# EAGLE design rcio_v1 (EAGLE 9.6.2)
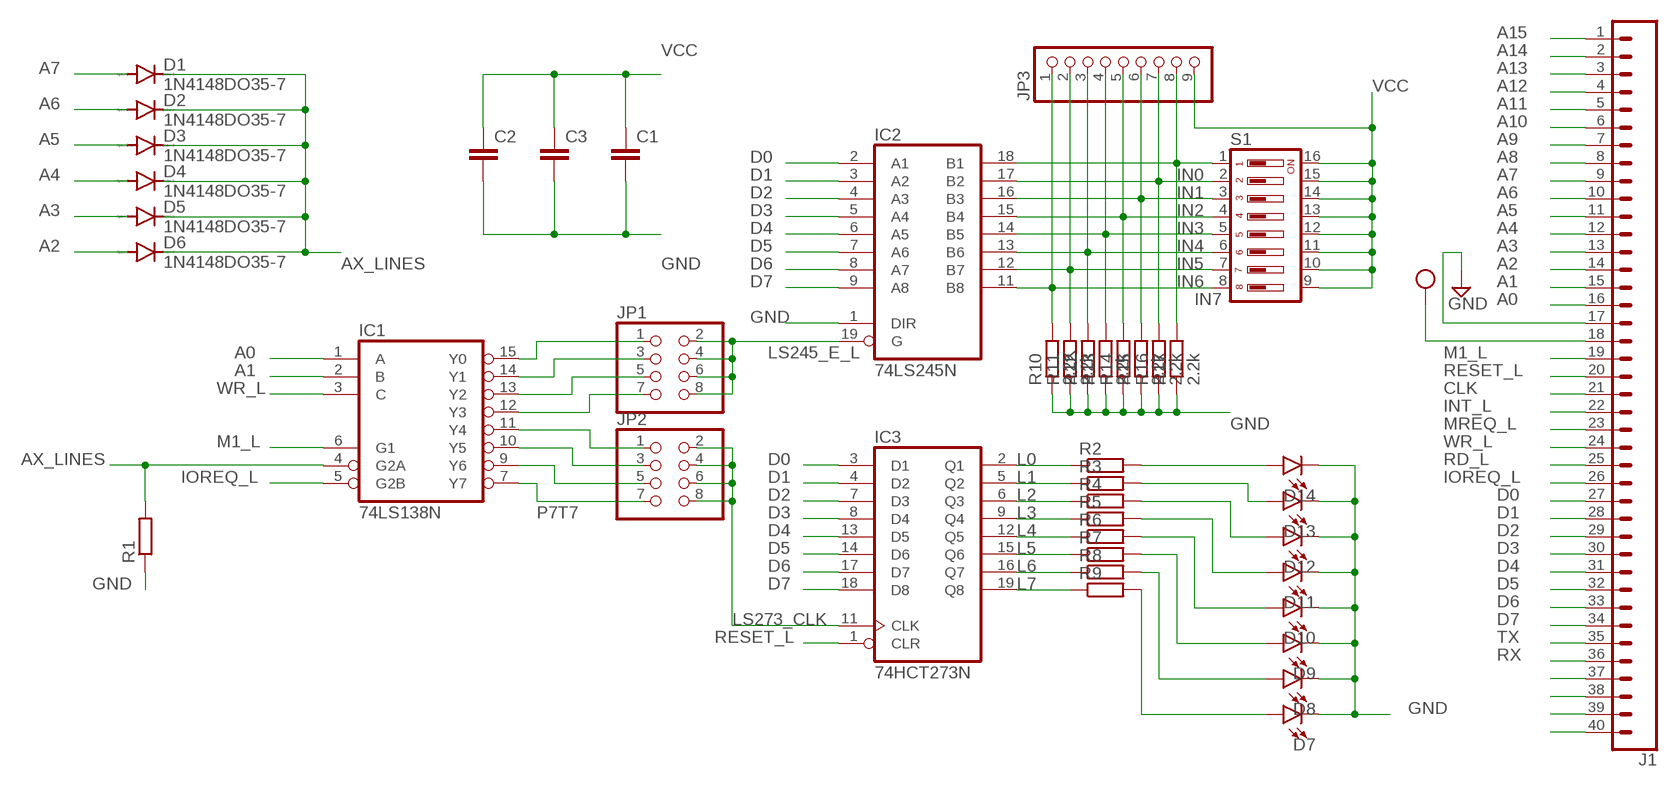
[diagram p0: schematic, sheet 1]

## Parts
C1  C-EU050-025X075  [C050-025X075]
C2  C-EU050-025X075  [C050-025X075]
C3  C-EU050-025X075  [C050-025X075]
D1  1N4148DO35-7  [DO35-7]
D2  1N4148DO35-7  [DO35-7]
D3  1N4148DO35-7  [DO35-7]
D4  1N4148DO35-7  [DO35-7]
D5  1N4148DO35-7  [DO35-7]
D6  1N4148DO35-7  [DO35-7]
D7  LED3MM  [LED_3MM]
D8  LED3MM  [LED_3MM]
D9  LED3MM  [LED_3MM]
D10  LED3MM  [LED_3MM]
D11  LED3MM  [LED_3MM]
D12  LED3MM  [LED_3MM]
D13  LED3MM  [LED_3MM]
D14  LED3MM  [LED_3MM]
IC1  74LS138N  [DIL16]
IC2  74LS245N  [DIL20]
IC3  74HCT273N  [DIL20]
J1  CONN_40OFFSET  [1X40_OFFSET]
JP1  PINHD-2X4  [2X04]
JP2  PINHD-2X4  [2X04]
JP3  PINHD-1X9  [1X09]
R1  R-EU_0204/7  [0204/7]
R2  R-EU_0204/7  [0204/7]
R3  R-EU_0204/7  [0204/7]
R4  R-EU_0204/7  [0204/7]
R5  R-EU_0204/7  [0204/7]
R6  R-EU_0204/7  [0204/7]
R7  R-EU_0204/7  [0204/7]
R8  R-EU_0204/7  [0204/7]
R9  R-EU_0204/7  [0204/7]
R10  2.2K  R-EU_0204/7  [0204/7]
R11  2.2k  R-EU_0204/7  [0204/7]
R12  R-EU_0204/7  [0204/7]
R13  2.2k  R-EU_0204/7  [0204/7]
R14  R-EU_0204/7  [0204/7]
R15  2.2k  R-EU_0204/7  [0204/7]
R16  2.2k  R-EU_0204/7  [0204/7]
R17  2.2k  R-EU_0204/7  [0204/7]
S1  DP08  [DP-08]

## Nets
A0: IC1.1(A) J1.16
A1: IC1.2(B) J1.15
A2: D6.A J1.14
A3: D5.A J1.13
A4: D4.A J1.12
A5: D3.A J1.11
A6: D2.A J1.10
A7: D1.A J1.9
A8: J1.8
A9: J1.7
A10: J1.6
A11: J1.5
A12: J1.4
A13: J1.3
A14: J1.2
A15: J1.1
AX_LINES: D1.C D2.C D3.C D4.C D5.C D6.C IC1.4(G2A) R1.2
CLK: J1.21
D0: IC2.2(A1) IC3.3(D1) J1.27
D1: IC2.3(A2) IC3.4(D2) J1.28
D2: IC2.4(A3) IC3.7(D3) J1.29
D3: IC2.5(A4) IC3.8(D4) J1.30
D4: IC2.6(A5) IC3.13(D5) J1.31
D5: IC2.7(A6) IC3.14(D6) J1.32
D6: IC2.8(A7) IC3.17(D7) J1.33
D7: IC2.9(A8) IC3.18(D8) J1.34
GND: C1.2 C2.2 C3.2 D7.K(C) D8.K(C) D9.K(C) D10.K(C) D11.K(C) D12.K(C) D13.K(C) D14.K(C) IC2.1(DIR) J1.17 R1.1 R10.1 R11.1 R12.1 R13.1 R14.1 R15.1 R16.1 R17.1
IN0: IC2.18(B1) JP3.8 R17.2 S1.1
IN1: IC2.17(B2) JP3.7 R16.2 S1.2
IN2: IC2.16(B3) JP3.6 R15.2 S1.3
IN3: IC2.15(B4) JP3.5 R14.2 S1.4
IN4: IC2.14(B5) JP3.4 R13.2 S1.5
IN5: IC2.13(B6) JP3.3 R12.2 S1.6
IN6: IC2.12(B7) JP3.2 R11.2 S1.7
IN7: IC2.11(B8) JP3.1 R10.2 S1.8
INT_L: J1.22
IOREQ_L: IC1.5(G2B) J1.26
L0: IC3.2(Q1) R2.1
L1: IC3.5(Q2) R3.1
L2: IC3.6(Q3) R4.1
L3: IC3.9(Q4) R5.1
L4: IC3.12(Q5) R6.1
L5: IC3.15(Q6) R7.1
L6: IC3.16(Q7) R8.1
L7: IC3.19(Q8) R9.1
LED7: D7.A R9.2
LS245_E_L: IC2.19(G) JP1.2 JP1.4 JP1.6 JP1.8
LS273_CLK: IC3.11(CLK) JP2.2 JP2.4 JP2.6 JP2.8
M1_L: IC1.6(G1) J1.19
MREQ_L: J1.23
N$1: J1.37
N$2: J1.38
N$3: J1.39
N$4: IC1.15(Y0) JP1.1
N$5: IC1.14(Y1) JP1.3
N$6: IC1.13(Y2) JP1.5
N$7: IC1.12(Y3) JP1.7
N$8: IC1.11(Y4) JP2.1
N$9: IC1.10(Y5) JP2.3
N$10: IC1.9(Y6) JP2.5
N$13: J1.40
N$23: D14.A R2.2
N$24: D13.A R3.2
N$25: D12.A R4.2
N$26: D11.A R5.2
N$27: D10.A R6.2
N$28: D9.A R7.2
N$29: D8.A R8.2
P7T7: IC1.7(Y7) JP2.7
RD_L: J1.25
RESET_L: IC3.1(CLR) J1.20
RX: J1.36
TX: J1.35
VCC: C1.1 C2.1 C3.1 J1.18 JP3.9 S1.9 S1.10 S1.11 S1.12 S1.13 S1.14 S1.15 S1.16
WR_L: IC1.3(C) J1.24

## Power pins joined to a net without a drawn wire
GND: IC1.8(GND) IC2.10(GND) IC3.10(GND)
VCC: IC1.16(VCC) IC2.20(VCC) IC3.20(VCC)

## Library data of the parts
C1 = rcl:C-EU: CAPACITOR, European symbol; SPICEPREFIX: C
C2 C3 = LabE:C-EU: CAPACITOR, European symbol; SPICEPREFIX: C
D1-D6 = diode:1N4148: DIODE high speed (Philips)
D7-D14 = SparkFun-LED:LED: LED (Generic) Standard schematic elements and footprints for 5mm, 3mm, 1206, and 0603 sized LEDs. Generic LEDs with no color specified.; PROD_ID: DIO-08794
IC1 = 74xx-eu:74*138: 3-line to 8-line DECODER/DEMULTIPLEXER
IC2 = 74xx-eu:74*245: Octal BUS TRANSCEIVER, 3-state
IC3 = 74xx-eu:74*273: Octal D type FLIP FLOP, clear
J1 = SparkFun-Connectors:CONN_40: Multi connection point. Often used as Generic Header-pin footprint for 0.1 inch spaced/style header connections On any of the 0.1 inch spaced packages, you can populate with these: Break Away Headers - Straight <https://www.sparkfun.com/products/116> (PRT-00116) Break Away Male Headers - Right Angle <https://www.sparkfun.com/products/553> (PRT-00553) Female Headers <https://www.sparkfun.com/products/115> (PRT-00115) Break Away Headers - Machine Pin <https://www.sparkfun.com/products/117> (PRT-00117) Break Away Female Headers - Swiss Machine Pin <https://www.sparkfun.com/products/743> (PRT-00743) For SCREWTERMINALS and SPRING TERMINALS visit here: Screw Terimnals on SparkFun.com <https://www.sparkfun.com/search/results?term=Screw+Terminals> (5mm/3.5mm/2.54mm spacing) This device is also useful as a general connection point to wire up your design to another part of your project. Our various solder wires solder well into these plated through hole pads. Hook-Up Wire - Assortment (Stranded, 22 AWG) <https://www.sparkfun.com/products/11375> (PRT-11375) Hook-Up Wire - Assortment (Solid Core, 22 AWG) <https://www.sparkfun.com/products/11367> (PRT-11367) View the entire wire category on our website here <https://www.sparkfun.com/categories/141> Special notes: Molex polarized connector foot print use with SKU : PRT-08231 with associated crimp pins and housings. 1MM SMD Version SKU: PRT-10208 NOTES ON THE VARIANTS LOCK and LOCK_LONGPADS... This footprint was designed to help hold the alignment of a through-hole component (i.e. 6-pin header) while soldering it into place. You may notice that each hole has been shifted either up or down by 0.005 of an inch from it's more standard position (which is a perfectly straight line). This slight alteration caused the pins (the squares in the middle) to touch the edges of the holes. Because they are alternating, it causes a "brace" to hold the component in place. 0.005 has proven to be the perfect amount of "off-center" position when using our standard breakaway headers. Although looks a little odd when you look at the bare footprint, once you have a header in there, the alteration is very hard to notice. Also,if you push a header all the way into place, it is covered up entirely on the bottom side.
JP1 JP2 = pinhead:PINHD-2X4: PIN HEADER
JP3 = pinhead:PINHD-1X9: PIN HEADER
R1-R17 = rcl:R-EU_: RESISTOR, European symbol; SPICEPREFIX: R
S1 = switch-dil:DP08: DIL/CODE SWITCH; MPN: DP08; OC_FARNELL: 9471626; OC_NEWARK: 73J0035

## Board
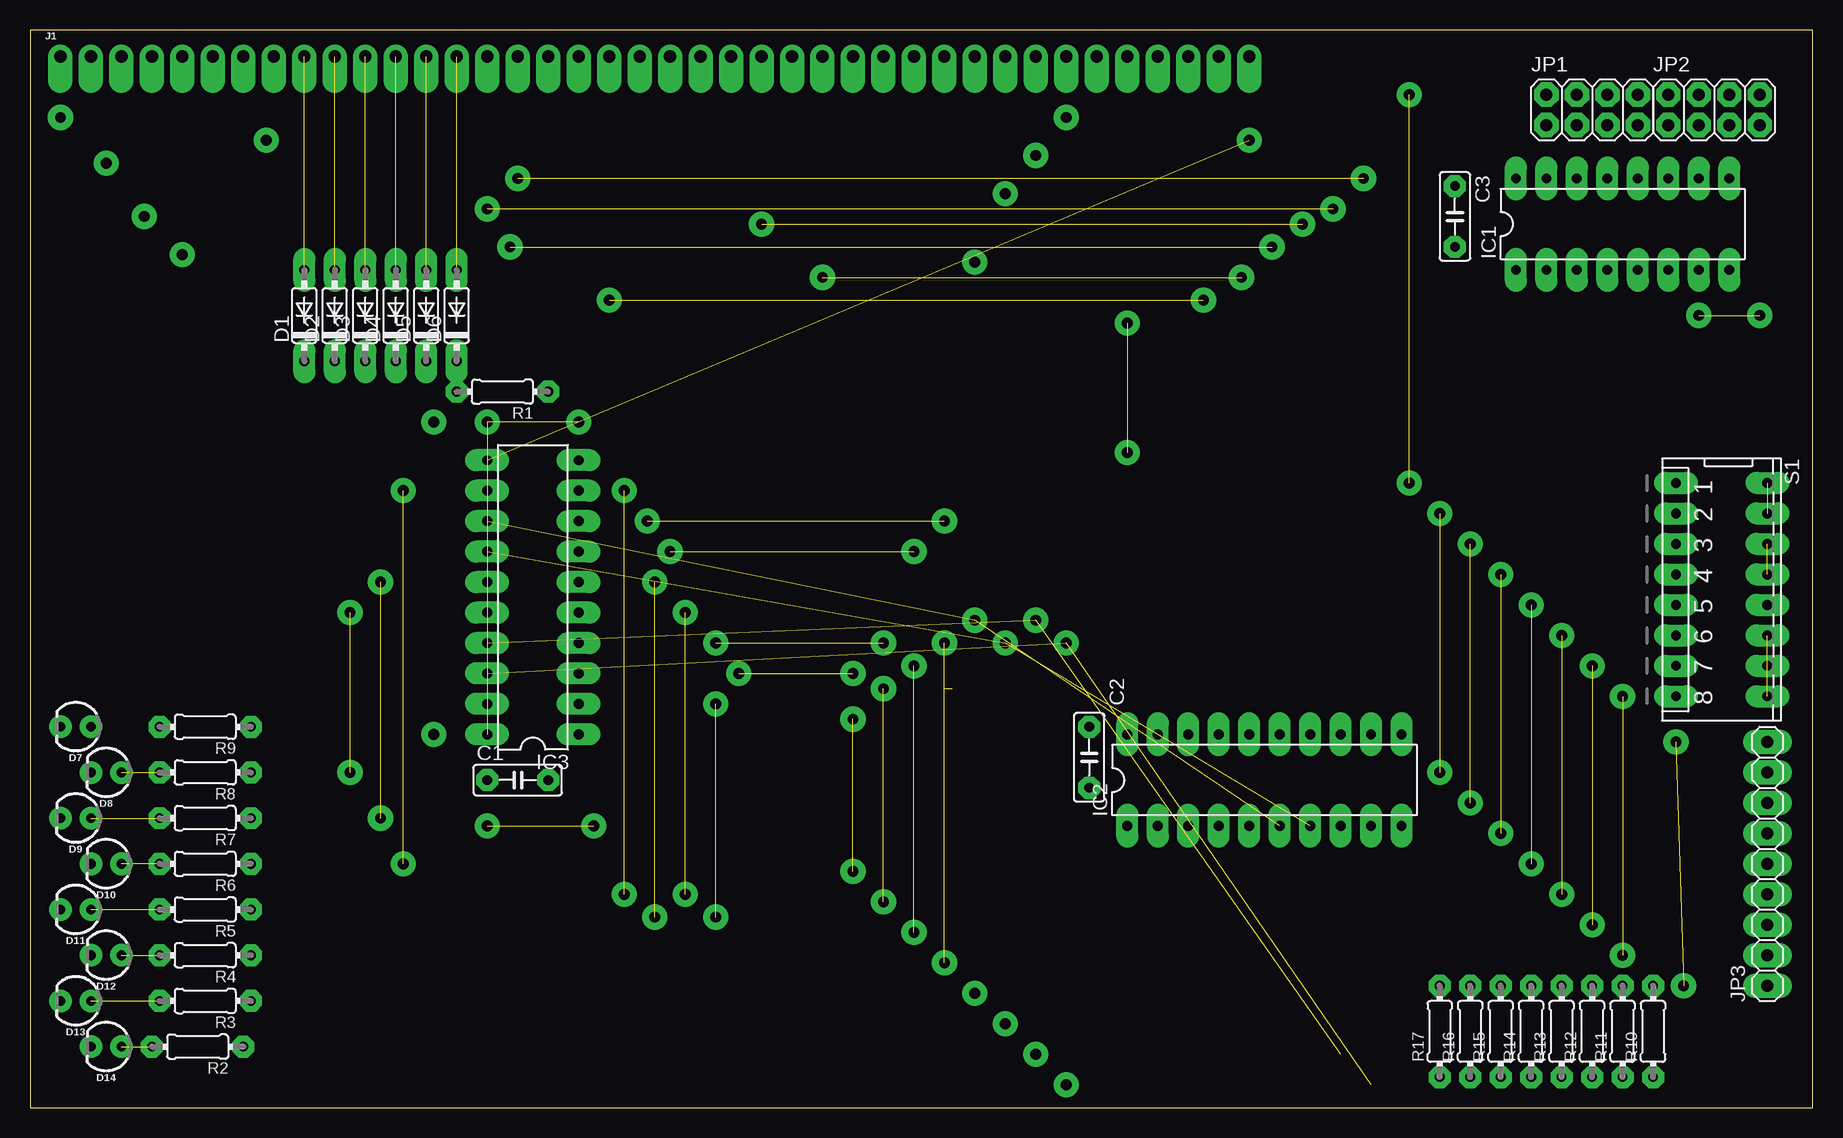
[diagram p1: board, top side]
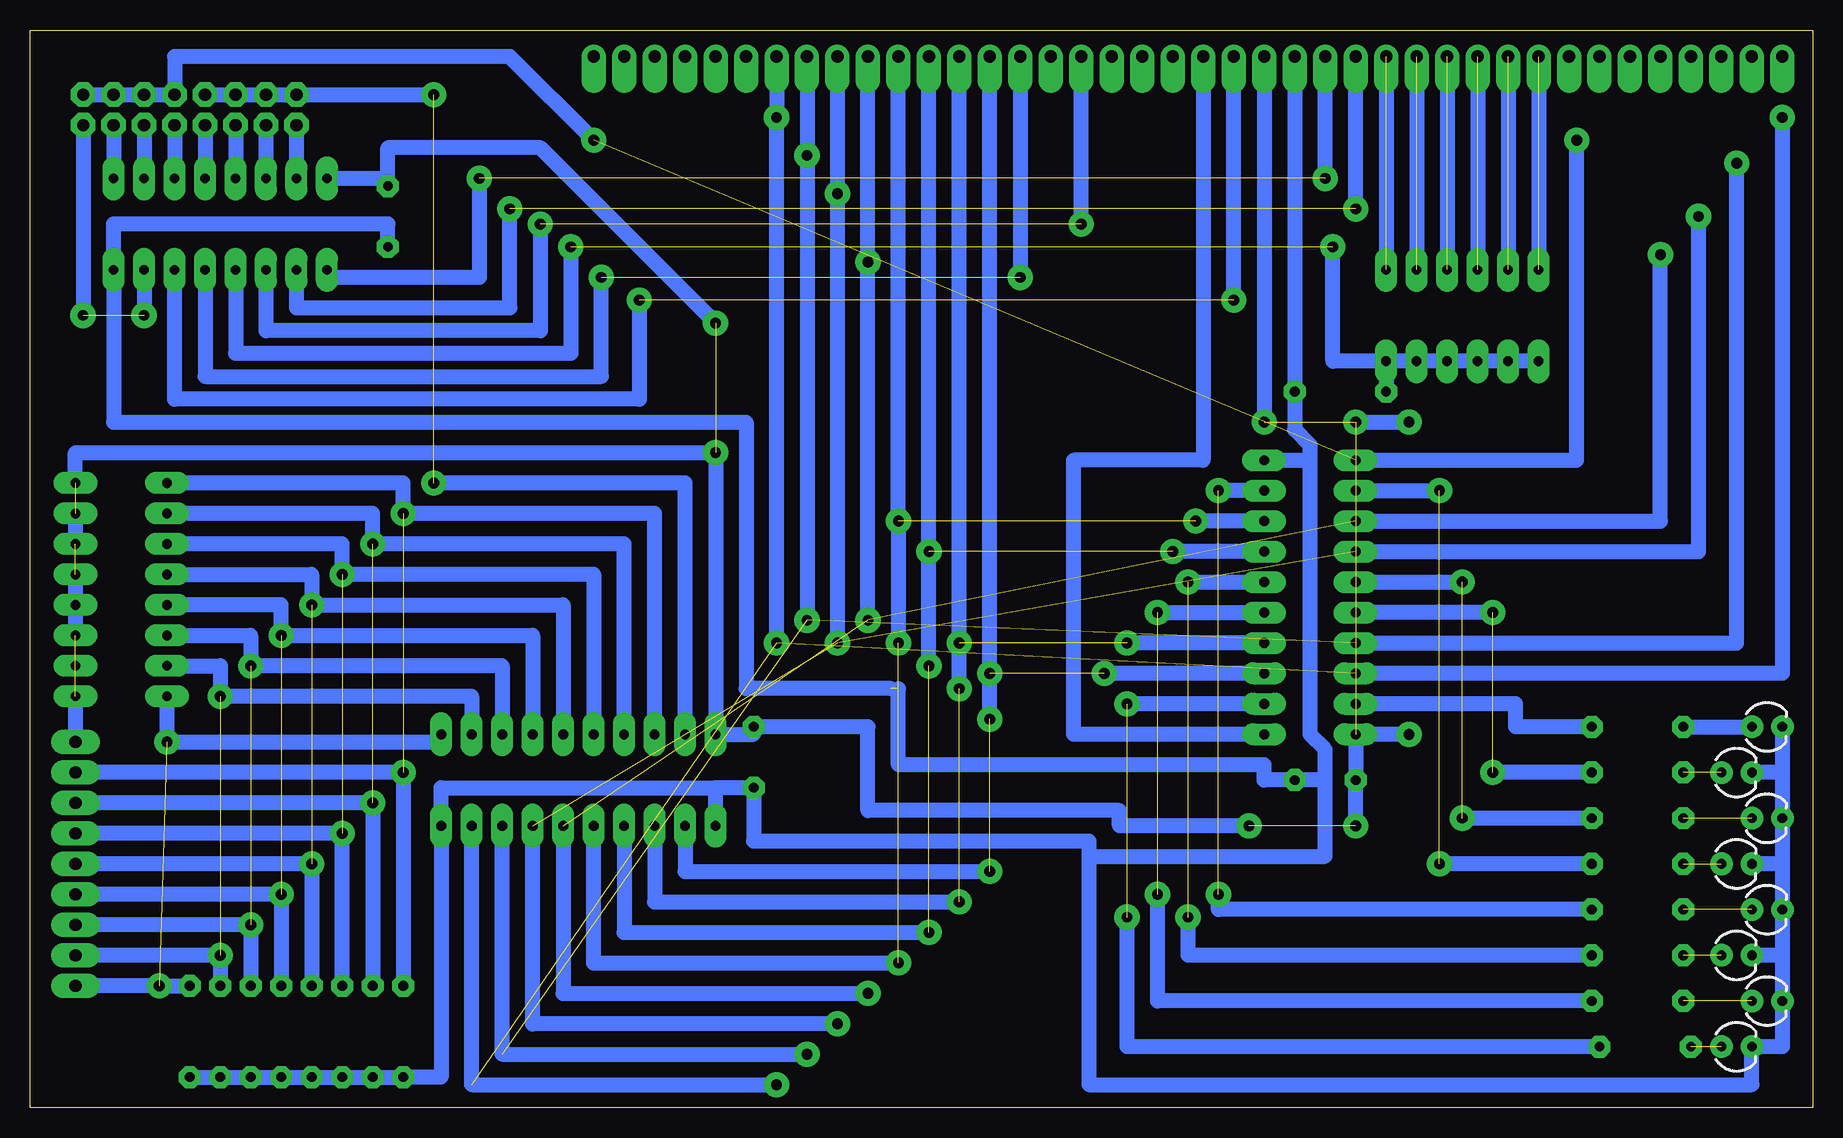
[diagram p2: board, bottom side, seen from below]

Size 148.57 x 89.84 mm. Coordinates in mm from the lower left corner, seen from the top.
Outline: 0,0 148.57,0 148.57,89.84 0,89.84 0,0
Copper layers (1*16): Top 0.035mm / dielectric 1.5mm / Bottom 0.035mm
Design rules "LabE": minimum track width 50mil, minimum drill 0.8mm, track to track 16mil, track to pad 16mil, pad to pad 16mil, via to via 16mil, smd to smd 16mil, copper to edge 0mil, drill to drill 16mil, minimum pad ring 20mil, minimum via ring 20mil, stop-mask expansion 4mil, vias tented up to drill 0mil, thermal gap 10mil

### Footprints (pad centres in the part's own frame; a part is rotated, then mirrored left to right if it is on the bottom)
C050-025X075 = drill 0.813 octagon: 1 -2.54,0; 2 2.54,0
DO35-7 = drill 0.813 long: A 3.81,0; C -3.81,0
LED_3MM = drill 0.813 pad 1.88: A -1.27,0; K 1.27,0
DIL16 = drill 0.813 long: 1 -8.89,-3.81; 2 -6.35,-3.81; 3 -3.81,-3.81; 4 -1.27,-3.81; 5 1.27,-3.81; 6 3.81,-3.81; 7 6.35,-3.81; 8 8.89,-3.81; 9 8.89,3.81; 10 6.35,3.81; 11 3.81,3.81; 12 1.27,3.81; 13 -1.27,3.81; 14 -3.81,3.81; 15 -6.35,3.81; 16 -8.89,3.81
DIL20 = drill 0.813 long: 1 -11.43,-3.81; 2 -8.89,-3.81; 3 -6.35,-3.81; 4 -3.81,-3.81; 5 -1.27,-3.81; 6 1.27,-3.81; 7 3.81,-3.81; 8 6.35,-3.81; 9 8.89,-3.81; 10 11.43,-3.81; 11 11.43,3.81; 12 8.89,3.81; 13 6.35,3.81; 14 3.81,3.81; 15 1.27,3.81; 16 -1.27,3.81; 17 -3.81,3.81; 18 -6.35,3.81; 19 -8.89,3.81; 20 -11.43,3.81
1X40_OFFSET = drill 1.016 pad 1.88 offset: 1 0,0; 2 2.54,0; 3 5.08,0; 4 7.62,0; 5 10.16,0; 6 12.7,0; 7 15.24,0; 8 17.78,0; 9 20.32,0; 10 22.86,0; 11 25.4,0; 12 27.94,0; 13 30.48,0; 14 33.02,0; 15 35.56,0; 16 38.1,0; 17 40.64,0; 18 43.18,0; 19 45.72,0; 20 48.26,0; 21 50.8,0; 22 53.34,0; 23 55.88,0; 24 58.42,0; 25 60.96,0; 26 63.5,0; 27 66.04,0; 28 68.58,0; 29 71.12,0; 30 73.66,0; 31 76.2,0; 32 78.74,0; 33 81.28,0; 34 83.82,0; 35 86.36,0; 36 88.9,0; 37 91.44,0; 38 93.98,0; 39 96.52,0; 40 99.06,0
2X04 = drill 1.016 octagon: 1 -3.81,-1.27; 2 -3.81,1.27; 3 -1.27,-1.27; 4 -1.27,1.27; 5 1.27,-1.27; 6 1.27,1.27; 7 3.81,-1.27; 8 3.81,1.27
1X09 = drill 1.016 long: 1 -10.16,0; 2 -7.62,0; 3 -5.08,0; 4 -2.54,0; 5 0,0; 6 2.54,0; 7 5.08,0; 8 7.62,0; 9 10.16,0
0204/7 = drill 0.813 octagon: 1 -3.81,0; 2 3.81,0
DP-08 = drill 0.813 long: 1 -8.89,-3.81; 2 -6.35,-3.81; 3 -3.81,-3.81; 4 -1.27,-3.81; 5 1.27,-3.81; 6 3.81,-3.81; 7 6.35,-3.81; 8 8.89,-3.81; 9 8.89,3.81; 10 6.35,3.81; 11 3.81,3.81; 12 1.27,3.81; 13 -1.27,3.81; 14 -3.81,3.81; 15 -6.35,3.81; 16 -8.89,3.81

### Placement (x,y rotation side)
C1  40.64,27.3 0 top
C2  88.27,29.21 270 top
C3  118.75,74.3 270 top
D1  22.86,66.04 90 top
D2  25.4,66.04 90 top
D3  27.94,66.04 90 top
D4  30.48,66.04 90 top
D5  33.02,66.04 90 top
D6  35.56,66.04 90 top
D7  3.81,31.75 180 top
D8  6.35,27.94 180 top
D9  3.81,24.13 180 top
D10  6.35,20.32 180 top
D11  3.81,16.51 180 top
D12  6.35,12.7 180 top
D13  3.81,8.89 180 top
D14  6.35,5.08 180 top
IC1  132.72,73.66 0 top
IC2  102.87,27.3 0 top
IC3  41.91,42.55 90 top
J1  2.54,87.63 0 top
JP1  130.18,83.19 0 top
JP2  140.34,83.19 0 top
JP3  144.78,20.32 90 top
R1  39.37,59.69 180 top
R2  13.97,5.08 180 top
R3  14.61,8.89 180 top
R4  14.61,12.7 180 top
R5  14.61,16.51 180 top
R6  14.61,20.32 180 top
R7  14.61,24.13 180 top
R8  14.61,27.94 180 top
R9  14.61,31.75 180 top
R10  135.25,6.35 90 top
R11  132.72,6.35 90 top
R12  130.18,6.35 90 top
R13  127.64,6.35 90 top
R14  125.09,6.35 90 top
R15  122.56,6.35 90 top
R16  120.02,6.35 90 top
R17  117.47,6.35 90 top
S1  140.97,43.18 270 top

### Tracks (layer width: path | path; a pad name or v marks a point on that pad's centre or on a via)
A0  (via drill 0.9 pad 2.1)  (1 unrouted)
  Bottom 1.27: IC1.1 123.19,69.22 111.12,69.22 v111.12,77.47 | v40.64,77.47 J1.16
A1  (via drill 0.9 pad 2.1)  (1 unrouted)
  Bottom 1.27: IC1.2 126.36,66.67 108.58,66.67 v108.58,74.93 | v38.1,74.93 J1.15
A2  (1 unrouted)
  Bottom 1.27: J1.14 D6.A
A3  (1 unrouted)
  Bottom 1.27: J1.13 D5.A
A4  (1 unrouted)
  Bottom 1.27: J1.12 D4.A
A5  (1 unrouted)
  Bottom 1.27: J1.11 D3.A
A6  (1 unrouted)
  Bottom 1.27: J1.10 D2.A
A7  (1 unrouted)
  Bottom 1.27: J1.9 D1.A
AX_LINES  (via drill 0.9 pad 2.1)  (1 unrouted)
  Bottom 1.27: D6.C R1.2 | D1.C D2.C D3.C D4.C D5.C D6.C | IC1.4 131.44,62.87 103.5,62.87 v103.5,71.75 | D6.C 40.01,62.23 v40.01,71.75
D0  (via drill 0.9 pad 2.1)  (2 unrouted)
  Bottom 1.27: IC2.2 93.98,19.68 v68.58,19.68 | J1.27 v68.58,36.2 v68.58,32.38 | IC3.3 v59.05,36.2
D1  (via drill 0.9 pad 2.1)  (2 unrouted)
  Bottom 1.27: IC2.3 96.52,17.14 v71.12,17.14 | J1.28 v71.12,38.73 v71.12,34.92 | IC3.4 v57.15,38.73
D2  (via drill 0.9 pad 2.1)  (2 unrouted)
  Bottom 1.27: IC2.4 99.06,14.61 v73.66,14.61 | IC3.7 v53.34,46.35 | J1.29 v73.66,46.35 v73.66,36.83
D3  (via drill 0.9 pad 2.1)  (2 unrouted)
  Bottom 1.27: IC2.5 101.6,12.06 v76.2,12.06 | IC3.8 v51.44,48.9 | J1.30 v76.2,48.9 v76.2,38.73
D4  (via drill 0.9 pad 2.1)  (2 unrouted)
  Bottom 1.27: IC3.13 12.7,48.9 v12.7,71.12 | J1.31 v78.74,70.48 v78.74,40.64 | IC2.6 104.14,9.53 v78.74,9.53
D5  (via drill 0.9 pad 2.1)  (2 unrouted)
  Bottom 1.27: IC2.7 106.68,6.99 v81.28,6.99 | IC3.14 9.53,46.35 v9.53,74.3 | J1.32 v81.28,76.2 v81.28,38.73
D6  (via drill 0.9 pad 2.1)  (2 unrouted)
  Bottom 1.27: IC2.8 109.22,4.45 v83.82,4.45 | J1.33 v83.82,79.38 v83.82,40.64 | IC3.17 6.35,38.73 v6.35,78.74
D7  (via drill 0.9 pad 2.1)  (2 unrouted)
  Bottom 1.27: IC2.9 111.76,1.91 v86.36,1.91 | v2.54,82.55 2.54,36.2 IC3.18 | J1.34 v86.36,82.55 v86.36,38.73
GND  (1 unrouted)
  Bottom 1.27: J1.17 R1.1 43.18,56.52 41.91,55.24 41.91,53.98 | R10.1 R11.1 R12.1 R13.1 R14.1 R15.1 R16.1 R17.1 114.3,2.54 IC2.10 114.3,26.67 91.44,26.67 | IC2.1 91.44,26.67 | 41.91,53.98 41.91,31.11 40.64,29.84 40.64,27.3 | 60.33,20.95 40.64,20.95 40.64,27.3 | 40.64,27.3 C1.2 45.72,27.3 45.72,28.57 76.2,28.57 76.2,34.92 | IC3.10 41.91,53.98 | C3.2 118.75,73.66 141.6,73.66 IC1.8 141.6,57.15 88.9,57.15 88.9,34.92 76.83,34.92 | D7.K 2.54,27.94 | 2.54,27.94 D8.K | 2.54,27.94 D9.K 2.54,20.32 | 2.54,20.32 D10.K | 2.54,20.32 D11.K 2.54,12.7 | 2.54,12.7 D12.K | 2.54,12.7 D13.K 2.54,5.08 D14.K 5.08,1.91 60.33,1.91 60.33,20.95 | 60.33,20.95 60.33,22.23 88.27,22.23 C2.2 91.44,26.67
IN0  (via drill 0.9 pad 2.1)  (1 unrouted)
  Bottom 1.27: IC2.18 96.52,49.53 v117.47,49.53 117.47,52.07 S1.1 | R17.2 v117.47,27.94 JP3.8
IN1  (via drill 0.9 pad 2.1)  (1 unrouted)
  Bottom 1.27: JP3.7 v120.02,25.4 R16.2 | S1.2 120.02,49.53 v120.02,46.99 99.06,46.99 IC2.17
IN2  (via drill 0.9 pad 2.1)  (1 unrouted)
  Bottom 1.27: IC2.16 101.6,44.45 v122.56,44.45 122.56,46.99 S1.3 | JP3.6 v122.56,22.86 R15.2
IN3  (via drill 0.9 pad 2.1)  (1 unrouted)
  Bottom 1.27: JP3.5 v125.09,20.32 R14.2 | S1.4 125.09,44.45 v125.09,41.91 104.14,41.91 IC2.15
IN4  (via drill 0.9 pad 2.1)  (1 unrouted)
  Bottom 1.27: IC2.14 106.68,39.37 v127.64,39.37 127.64,41.91 S1.5 | JP3.4 v127.64,17.78 R13.2
IN5  (via drill 0.9 pad 2.1)  (1 unrouted)
  Bottom 1.27: JP3.3 v130.18,15.24 R12.2 | IC2.13 109.22,36.83 v130.18,36.83 130.18,39.37 S1.6
IN6  (via drill 0.9 pad 2.1)  (1 unrouted)
  Bottom 1.27: IC2.12 111.76,34.29 v132.72,34.29 132.72,36.83 S1.7 | JP3.2 v132.72,12.7 R11.2
IN7  (via drill 0.9 pad 2.1)  (1 unrouted)
  Bottom 1.27: JP3.1 v137.79,10.16 R10.2 | S1.8 v137.16,30.48 114.94,30.48 IC2.11
IOREQ_L  (via drill 0.9 pad 2.1)  (1 unrouted)
  Bottom 1.27: J1.26 v66.04,69.22 | IC1.5 133.99,60.96 100.97,60.96 v100.97,69.22
L0  (via drill 0.9 pad 2.1)  (1 unrouted)
  Bottom 1.27: IC3.2 v57.15,33.66 | R2.1 57.15,5.08 v57.15,15.88
L1  (via drill 0.9 pad 2.1)  (1 unrouted)
  Bottom 1.27: v54.61,41.27 IC3.5 | R3.1 54.61,8.89 v54.61,17.78
L2  (via drill 0.9 pad 2.1)  (1 unrouted)
  Bottom 1.27: v52.07,43.81 IC3.6 | R4.1 52.07,12.7 v52.07,15.88
L3  (via drill 0.9 pad 2.1)  (1 unrouted)
  Bottom 1.27: IC3.9 v49.53,51.44 | v49.53,17.78 49.53,16.51 R5.1
L4  (via drill 0.9 pad 2.1)  (1 unrouted)
  Bottom 1.27: IC3.12 v31.11,51.44 | R6.1 v31.11,20.32
L5  (via drill 0.9 pad 2.1)  (1 unrouted)
  Bottom 1.27: IC3.15 v29.21,43.81 | R7.1 v29.21,24.13
L6  (via drill 0.9 pad 2.1)  (1 unrouted)
  Bottom 1.27: v26.67,41.27 IC3.16 | R8.1 v26.67,27.94
L7
  Bottom 1.27: R9.1 24.77,31.75 24.77,33.66 IC3.19
LED7
  Bottom 1.27: R9.2 D7.A
LS245_E_L  (via drill 0.9 pad 2.1)  (1 unrouted)
  Bottom 1.27: IC2.19 93.98,52.07 v114.94,52.07 | v114.94,84.45 JP1.2 JP1.4 JP1.6 JP1.8
LS273_CLK  (via drill 0.9 pad 2.1)  (1 unrouted)
  Bottom 1.27: JP2.8 JP2.6 JP2.4 JP2.2 136.53,87.63 108.58,87.63 v101.6,80.64 | IC3.11 19.68,53.98 v19.68,80.64
M1_L  (via drill 0.9 pad 2.1)  (1 unrouted)
  Bottom 1.27: v48.26,67.31 J1.19 | v97.79,67.31 97.79,59.05 136.53,59.05 IC1.6
N$4
  Bottom 1.27: JP1.1 IC1.15
N$5
  Bottom 1.27: JP1.3 IC1.14
N$6
  Bottom 1.27: JP1.5 IC1.13
N$7
  Bottom 1.27: JP1.7 IC1.12
N$8
  Bottom 1.27: JP2.1 IC1.11
N$9
  Bottom 1.27: JP2.3 IC1.10
N$10
  Bottom 1.27: JP2.5 IC1.9
N$23  (1 unrouted)
N$24  (1 unrouted)
N$25  (1 unrouted)
N$26  (1 unrouted)
N$27  (1 unrouted)
N$28  (1 unrouted)
N$29  (1 unrouted)
P7T7  (via drill 0.9 pad 2.1)  (1 unrouted)
  Bottom 1.27: JP2.7 v144.15,66.04 | IC1.7 v139.06,66.04
RESET_L
  Bottom 1.27: J1.20 50.8,53.98 61.59,53.98 61.59,31.11 IC3.1
VCC  (via drill 0.9 pad 2.1)  (8 unrouted)
  Bottom 1.27: IC1.16 119.38,77.47 C3.1 118.75,80.01 106.05,80.01 v91.44,65.41 | S1.15 S1.14 | S1.13 S1.12 S1.11 | S1.9 JP3.9 | S1.16 144.78,54.61 v91.44,54.61 IC2.20 88.27,31.11 C2.1 78.74,31.75 78.74,24.77 57.78,24.77 57.78,23.5 v46.99,23.5 | J1.18 v45.72,57.15 | v33.66,31.11 IC3.20 C1.1 v38.1,23.5 | v38.1,57.15 v33.66,57.15
WR_L  (via drill 0.9 pad 2.1)  (1 unrouted)
  Bottom 1.27: IC1.3 128.91,64.77 106.05,64.77 v106.05,73.66 | v60.96,73.66 J1.24